# EAGLE design xmas-snow_sob (EAGLE 6.4)
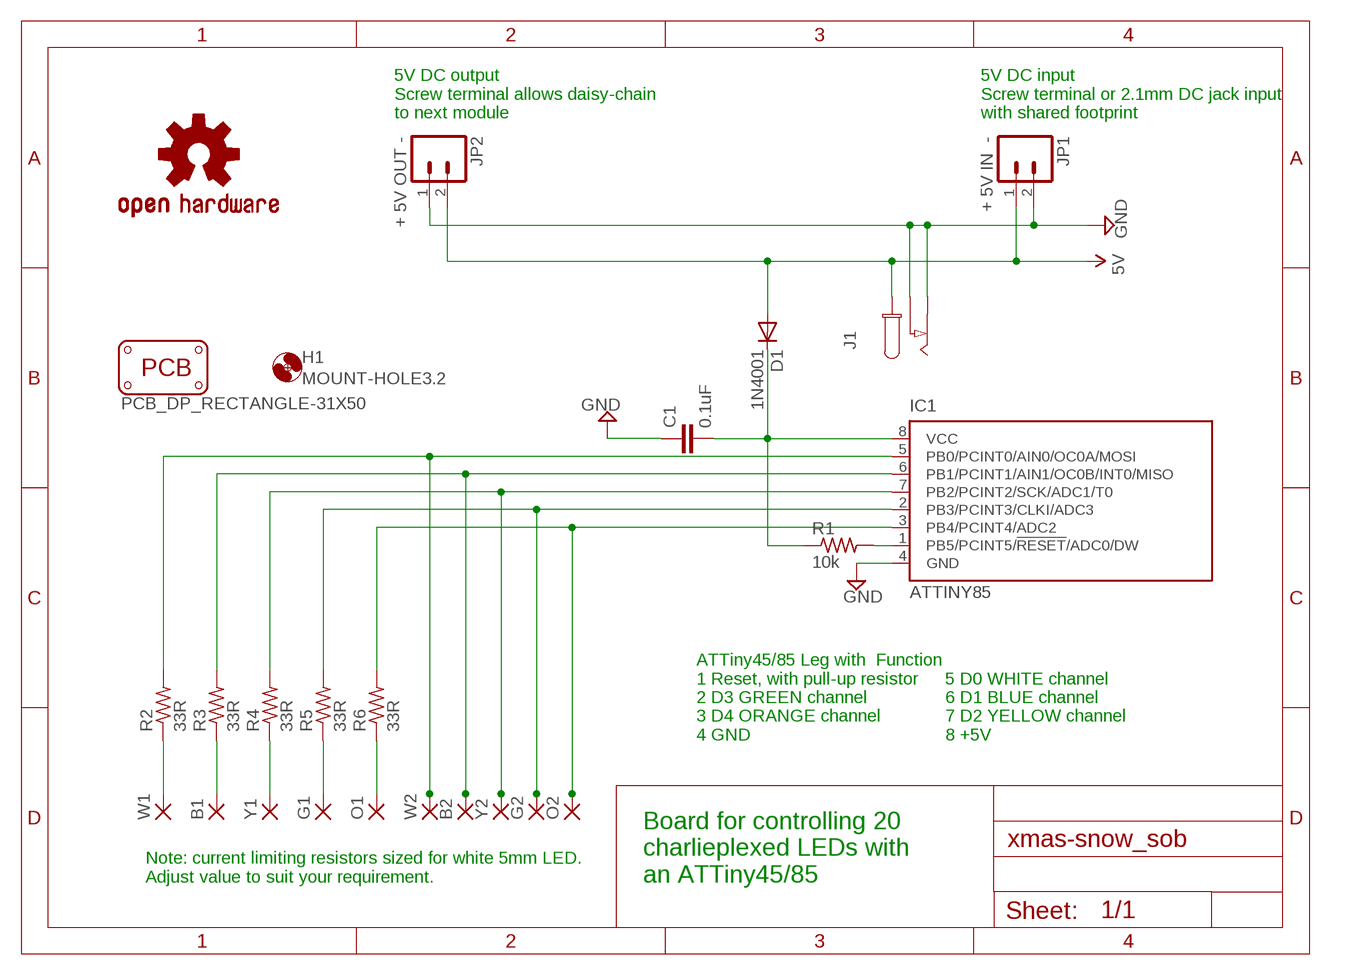
[diagram p0: schematic, sheet 1]

## Parts
B1  WIREPAD1,6/0,8  [1,6/0,8]
B2  WIREPAD1,6/0,8  [1,6/0,8]
C1  0.1uF  CAPPTH2  [CAP-PTH-SMALL2]
D1  1N4001  1N4004  [DO41-10]
G1  WIREPAD1,6/0,8  [1,6/0,8]
G2  WIREPAD1,6/0,8  [1,6/0,8]
H1  MOUNT-HOLE3.2  [3,2]
IC1  ATTINY85  TINY13-20PU  [DIL08]
J1  CON_DC_M-DC_PTH  [DC_BARREL_JACK_PTH_2MM]
JP1  + 5V IN -  M025MM  [SCREWTERMINAL-5MM-2]
JP2  + 5V OUT -  M025MM  [SCREWTERMINAL-5MM-2]
LOGO1  OSHW-LOGOL  [OSHW-LOGO-L]
O1  WIREPAD1,6/0,8  [1,6/0,8]
O2  WIREPAD1,6/0,8  [1,6/0,8]
PCB1  PCB_DP_RECTANGLE-31X50  [DP5031_V1]
R1  10k  R-US_0207/2V  [0207/2V]
R2  33R  R-US_0207/2V  [0207/2V]
R3  33R  R-US_0207/2V  [0207/2V]
R4  33R  R-US_0207/2V  [0207/2V]
R5  33R  R-US_0207/2V  [0207/2V]
R6  33R  R-US_0207/2V  [0207/2V]
W1  WIREPAD1,6/0,8  [1,6/0,8]
W2  WIREPAD1,6/0,8  [1,6/0,8]
Y1  WIREPAD1,6/0,8  [1,6/0,8]
Y2  WIREPAD1,6/0,8  [1,6/0,8]

## Nets
5V: C1.2 D1.A D1.C IC1.8(VCC) J1.P1 JP1.1 JP2.2 R1.1
GND: C1.1 IC1.4(GND) J1.P2(P3) J1.P3(P2) JP1.2 JP2.1
N$4: IC1.1(PB5/PCINT5/!RESET!/ADC0/DW) R1.2
N$5: IC1.5(PB0/PCINT0/AIN0/OC0A/MOSI) R2.2 W2.1(P)
N$6: B2.1(P) IC1.6(PB1/PCINT1/AIN1/OC0B/INT0/MISO) R3.2
N$7: IC1.7(PB2/PCINT2/SCK/ADC1/T0) R4.2 Y2.1(P)
N$8: G2.1(P) IC1.2(PB3/PCINT3/CLKI/ADC3) R5.2
N$9: IC1.3(PB4/PCINT4/ADC2) O2.1(P) R6.2
N$10: R2.1 W1.1(P)
N$11: B1.1(P) R3.1
N$12: R4.1 Y1.1(P)
N$13: G1.1(P) R5.1
N$14: O1.1(P) R6.1

## Notes on the sheet
- 5V DC output
  Screw terminal allows daisy-chain
  to next module
- 5V DC input
  Screw terminal or 2.1mm DC jack input
  with shared footprint
- ATTiny45/85 Leg with  Function
  1 Reset, with pull-up resistor
  2 D3 GREEN channel
  3 D4 ORANGE channel
  4 GND
- 5 D0 WHITE channel
  6 D1 BLUE channel
  7 D2 YELLOW channel
  8 +5V
- Note: current limiting resistors sized for white 5mm LED.
  Adjust value to suit your requirement.
- Board for controlling 20
  charlieplexed LEDs with
  an ATTiny45/85

## Library data of the parts
B1 B2 G1 G2 O1 O2 W1 W2 Y1 Y2 = wirepad:WIREPAD: Wire PAD connect wire on PCB
C1 = SparkFun-Passives:CAP: Capacitor Standard 0603 ceramic capacitor, and 0.1" leaded capacitor.
D1 = diode:1N4004: DIODE general purpose rectifier, 1 A
H1 = holes:MOUNT-HOLE: MOUNTING HOLE with drill center marker
IC1 = atmel:TINY13: 8-bit AVR Microcontroller with 1K Bytes In-System Programmable Flash Source: http://www.atmel.com/dyn/resources/prod_documents/2535S.pdf; MPN: ATTINY13-20PU; OC_FARNELL: 9171550; OC_NEWARK: 96K6521
J1 = dp_devices:CON_DC_M: DC power connector
JP1 JP2 = SparkFun-Connectors:M02: Header 2 Standard 2-pin 0.1" header. Use with straight break away headers (SKU : PRT-00116), right angle break away headers (PRT-00553), swiss pins (PRT-00743), machine pins (PRT-00117), and female headers (PRT-00115). Molex polarized connector foot print use with SKU : PRT-08233 with associated crimp pins and housings.
LOGO1 = SparkFun-Aesthetics:OSHW-LOGO: Open Source Hardware Logo This logo indicates the piece of hardware it is found on incorporates a OSHW license and/or adheres to the definition of open source hardware found here: http://freedomdefined.org/OSHW
PCB1 = dp_pcb:PCB_DP_RECTANGLE: Dangerous Prototypes Standard Rectangular PCB sizes
R1-R6 = resistor:R-US_: RESISTOR, American symbol

## Net classes
0 default: width 0.305 mm, drill 0.508 mm, clearance 0.254 mm

## Board
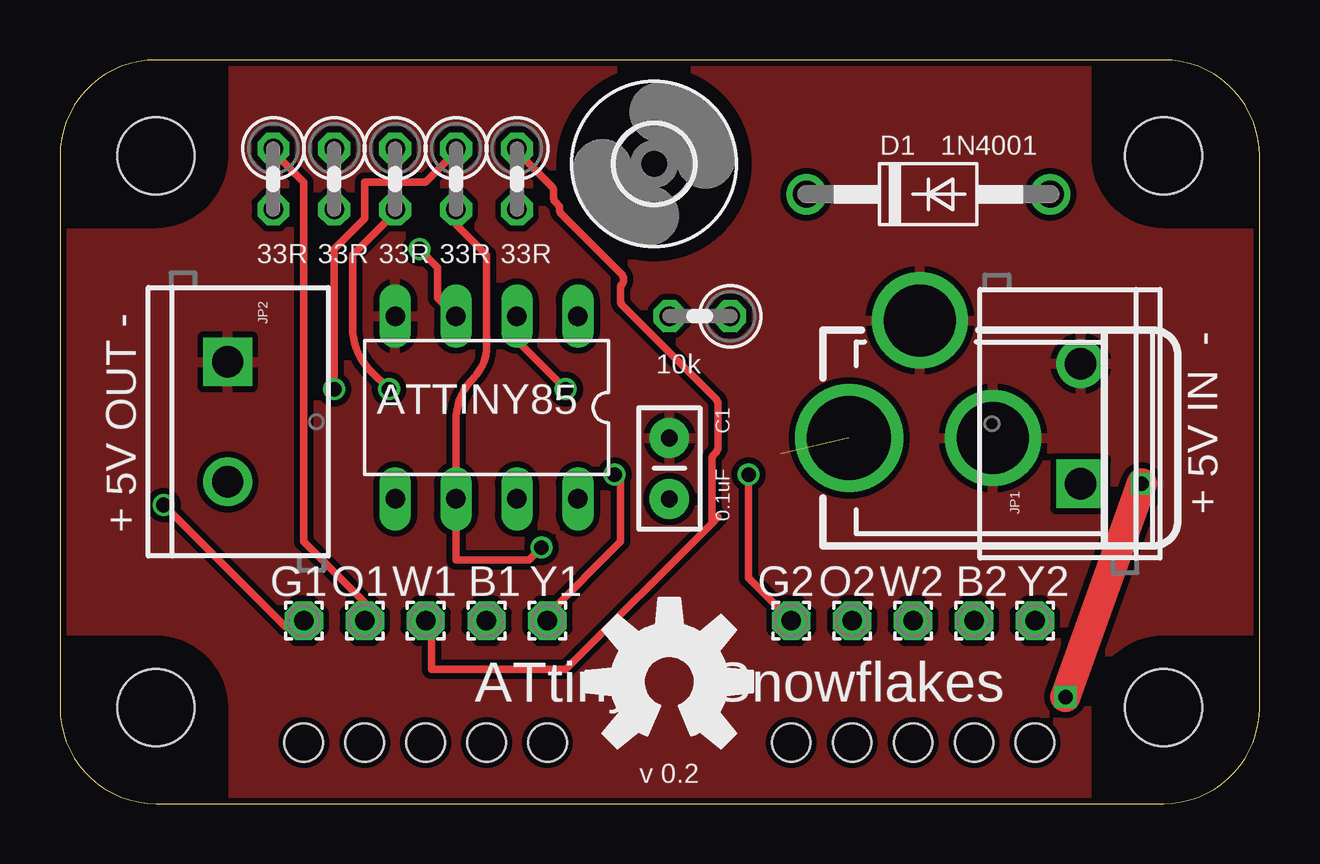
[diagram p1: board, top side]
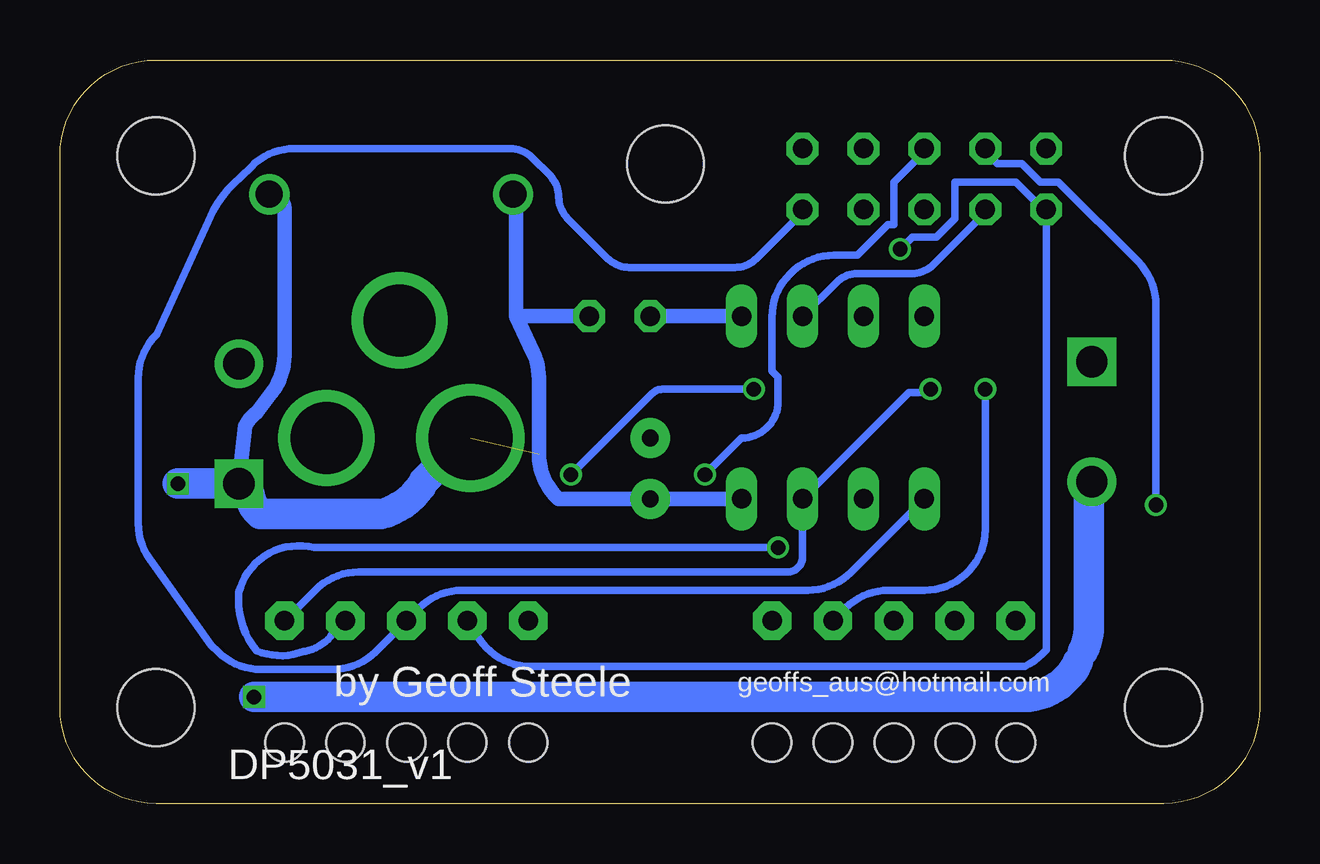
[diagram p2: board, bottom side, seen from below]

Size 50 x 31 mm. Coordinates in mm from the lower left corner, seen from the top.
Copper layers (1*16): Top 0.035mm / dielectric 1.5mm / Bottom 0.035mm
Design rules "Fusion_eagle_rule_v1.1": minimum track width 6mil, minimum drill 12mil, track to track 6mil, track to pad 6mil, pad to pad 6mil, via to via 6mil, smd to smd 0mil, copper to edge 10mil, drill to drill 10mil, minimum pad ring 10mil, minimum via ring 6mil, stop-mask expansion 2mil, vias tented up to drill 100mil, thermal gap 10mil
Holes 1.6 mm at 10.16,2.54 12.7,2.54 15.24,2.54 17.78,2.54 20.32,2.54 30.48,2.54 33.02,2.54 35.56,2.54 38.1,2.54 40.64,2.54

### Footprints (pad centres in the part's own frame; a part is rotated, then mirrored left to right if it is on the bottom)
1,6/0,8 = drill 0.813 pad 1.6 octagon: 1 0,0
CAP-PTH-SMALL2 = drill 0.7 pad 1.651: 1 0,0; 2 2.54,0
DO41-10 = drill 1.118: A 5.08,0; C -5.08,0
3,2 = hole 3.2: 0,0
DIL08 = drill 0.813 long: 1 -3.81,-3.81; 2 -1.27,-3.81; 3 1.27,-3.81; 4 3.81,-3.81; 5 3.81,3.81; 6 1.27,3.81; 7 -1.27,3.81; 8 -3.81,3.81
DC_BARREL_JACK_PTH_2MM = drill 3.5: P1 0,6.475 | drill 3: P2 4.9,3.525; P3 0,0.475
SCREWTERMINAL-5MM-2 = drill 1.3 pad 2.032 square: 1 0,0 | drill 1.3 pad 2.032: 2 5,0
DP5031_V1 = hole 3.2: 4,4; 46,4; 46,27; 4,27
0207/2V = drill 0.813 octagon: 1 -1.27,0; 2 1.27,0

### Placement (x,y rotation side)
B1  17.78,7.62 0 top
B2  38.1,7.62 0 top
C1  25.4,15.24 270 top
D1  36.2,25.4 0 top
G1  10.16,7.62 0 top
G2  30.48,7.62 0 top
H1  24.77,26.67 0 top
IC1  17.78,16.51 180 top
J1  39.37,15.24 90 top
JP1  42.55,13.34 90 top
JP2  6.99,18.41 270 top
LOGO1  25.4,5.08 0 top
O1  12.7,7.62 0 top
O2  33.02,7.62 0 top
PCB1  0,0 0 top
R1  26.67,20.32 180 top
R2  19.05,26.04 270 top
R3  16.51,26.04 270 top
R4  13.97,26.04 270 top
R5  11.43,26.04 270 top
R6  8.89,26.04 270 top
W1  15.24,7.62 0 top
W2  35.56,7.62 0 top
Y1  20.32,7.62 0 top
Y2  40.64,7.62 0 top

### Tracks (layer width: path | path; a pad name or v marks a point on that pad's centre or on a via)
5V  (via drill 0.6)  (1 unrouted)
  Top 1.27: v41.91,4.45 v45.09,13.34
  Bottom 0.305: 30.99,25.4 D1.C | 33.02,15.24 J1.P1 | 7.11,13.46 JP2.2
  Bottom 0.406: 7.36,6.34 7.57,5.9
  Bottom 0.61: IC1.8 C1.2 29.2,12.7 arc43 29.22,12.71 arc47 30.04,14.57 30.04,17.72 arc-25 30.28,18.8 30.99,20.32 | 30.99,20.32 30.99,25.4 | R1.1 30.99,20.32 | JP1.1 42.27,15.73 arc27 41.8,16.3 41.15,17.16 arc-37 40.64,18.69 40.64,24.77 arc-90 D1.A
  Bottom 1.27: 33.02,15.24 34.82,13.44 arc45 36.61,12.06 41.65,12.06 arc45 42.1,12.89 JP1.1 v45.09,13.34 | 7.11,13.46 7.11,7.43 arc25 7.36,6.34 | 7.57,5.9 arc65 9.86,4.45 v41.91,4.45
GND
  pour Top: -5.08,38.1 55.88,38.1 55.88,-5.08 -5.08,-5.08 -5.08,-2.54
N$4
  Bottom 0.61: R1.2 IC1.1
N$5
  Bottom 0.305: IC1.5 17.04,9.63 arc45 18.83,8.89 33.24,8.89 arc-45 35.03,8.15 W2.1 36.85,6.33 arc45 38.64,5.59 41.62,5.59 arc45 43.42,6.33 43.69,6.6 46.26,10.19 arc36 46.74,11.67 46.74,17.74 arc45 45.99,19.54 45.97,19.56 43.62,24.73 arc21 42.47,26.11 42.02,26.56 arc45 40.22,27.3 31.22,27.3 arc45 30.33,26.93 29.58,26.19 arc45 29.21,25.29 | R2.2 19.05,24.64 20.96,22.72 arc45 21.86,22.35 26.27,22.35 arc45 27.17,22.72 28.84,24.39 arc45 29.21,25.29 | 29.21,25.29
N$6  (via drill 0.61)
  Top 0.305: R3.2 16.51,24.13 17.78,22.86 17.78,19.03 arc-45 17.25,17.76 arc45 16.51,15.97 IC1.6 16.51,10.16 19.56,10.16 v20.07,10.67
  Bottom 0.305: B2.1 38.63,7.09 arc45 39.79,6.35 39.85,6.35 arc45 41.8,6.37 arc45 42.55,8.8 arc90 39.41,10.67 v20.07,10.67
N$7  (via drill 0.61)
  Top 0.305: v13.72,17.27 12.94,18.05 arc-45 12.19,19.85 12.19,22.86 13.97,24.64 R4.2
  Bottom 0.305: Y2.1 39.35,8.91 arc45 37.56,9.65 19.68,9.65 arc-90 19.05,10.29 IC1.7 14.61,17.14 14.02,17.14 arc-45 v13.72,17.27
N$8  (via drill 0.61)
  Top 0.305: G2.1 28.7,9.4 v28.7,13.72 | v21.08,17.27 19.05,19.3 IC1.2
  Bottom 0.305: IC1.2 17.64,21.73 arc45 16.75,22.1 14.5,22.1 arc-45 13.6,22.47 11.43,24.64 R5.2 | v21.08,17.27 24.88,17.27 arc-45 25.33,17.09 v28.7,13.72
N$9  (via drill 0.61)
  Top 0.305: IC1.3 15.75,21.08 15.75,22.35 v14.99,23.11
  Bottom 0.305: v14.99,23.11 14.48,23.62 13.46,23.62 12.7,24.38 12.7,25.91 10.16,25.91 9.14,24.89 8.89,24.89 R6.2 8.89,24.64 | O2.1 32.5,6.85 arc-56 30.39,5.71 9.79,5.71 arc-24 8.89,6.41 8.89,24.63
  Bottom 0.406: 8.89,24.64 arc-90 8.89,24.63
N$10
  Top 0.305: 27.18,11.68 27.18,14.35 arc-45 27.27,14.57 27.34,14.64 arc45 27.43,14.86 27.43,16.63 arc45 27.34,16.86 23.46,20.73 arc-45 23.37,20.96 23.37,21.55 arc-45 23.4,21.62 arc90 23.4,22.07 20.92,24.55 arc-45 20.83,24.77 20.83,24.89 20.67,25.05 arc-45 20.57,25.28 20.57,25.52 arc45 20.48,25.75 19.05,27.18 R2.1 | 27.18,11.68 21.08,5.59 15.49,5.59 15.49,7.37 W1.1 | 27.18,11.68 27.43,11.94
N$11  (via drill 0.61)
  Top 0.305: v11.43,17.27 11.43,23.11 12.7,24.38 12.7,25.91 15.24,25.91 16.51,27.18 R3.1
  Bottom 0.305: v11.43,17.27 11.43,11.43 arc90 13.97,8.89 15.46,8.89 arc-45 17.25,8.15 B1.1
N$12  (via drill 0.61)
  Top 0.305: v23.11,13.72 23.37,13.46 23.37,10.92 20.32,7.87 Y1.1
  Bottom 0.305: v23.11,13.72 21.59,15.24 arc-90 20.07,16.76 20.07,17.78 20.32,18.03 20.32,20.28 arc45 19.58,22.08 19.54,22.12 arc45 17.74,22.86 16.76,22.86 15.49,24.13 15.24,24.13 15.24,25.91 13.97,27.18 R4.1
N$13  (via drill 0.61)
  Top 0.305: v4.32,12.45 9.4,7.37 10.16,7.37 G1.1
  Bottom 0.305: v4.32,12.45 4.32,20.79 arc-45 5.06,22.59 8.38,25.91 9.14,25.91 9.91,26.67 10.92,26.67 11.43,27.18 R5.1
N$14
  Top 0.305: O1.1 12.7,8.38 10.16,10.92 10.16,25.91 8.89,27.18 R6.1

### Text on the board
tNames: ATtiny Snowflakes | v 0.2
bNames: geoffs_aus@hotmail.com | by Geoff Steele